# Altium project Pzem004T_Iot.PrjPCB
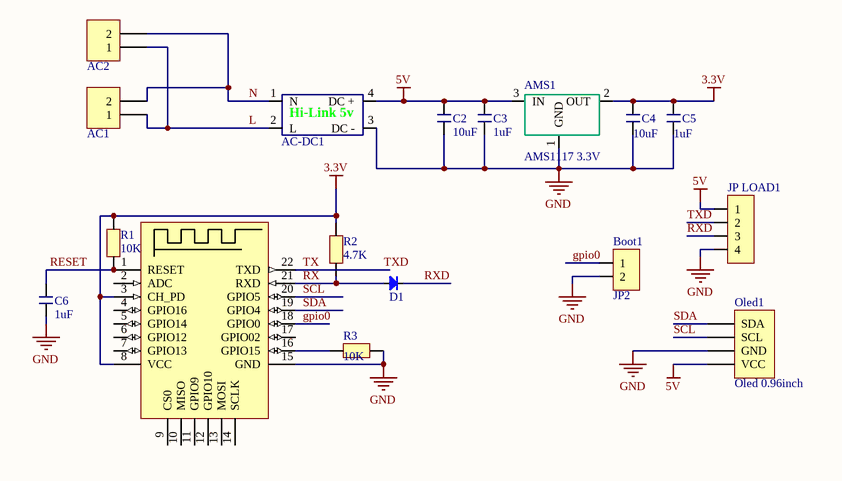
[diagram p0: Schematic.SchDoc]
1 sheet, 17 parts. Net scope: global (net labels, ports and power ports of the same name join across sheets).
Board file: PCB.PcbDoc

## Sheet Schematic.SchDoc
size A

### Parts
AC1  KF2  [KF2-5.08]  (value not drawn)
AC2  KF2  [KF2-5.08]  (value not drawn)
AC-DC1  Hi-link 5v  [Hi-Link]  (value not drawn)
AMS1  AMS1117 3.3V  [AMS-1117]
Boot1  JP2  [JP2-D1T]
C2  10uF  [0805]
C3  1uF  [0805]
C4  10uF  [0805]
C5  1uF  [0805]
C6  1uF  [0805]
D1  Diode  [DIO-1AN]  (value not drawn)
JP_LOAD1  JP4  [JP4-D1C]  (value not drawn)
MCU1  (no value)  [Esp12]
Oled1  Oled 0.96inch  [Oled 0.96]
R1  10K  [0805]
R2  4.7K  [0805]
R3  10K  [0805]

### Nets
3.3V: AMS1.2(OUT) C4.1 C5.1 MCU1.3(CH_PD) MCU1.8(VCC) R1.2 R2.2
5V: AC-DC1.4(DC_+) AMS1.3(IN) C2.1 C3.1 JP_LOAD1.1 Oled1.1(VCC)
GND: AC-DC1.3(DC_-) AMS1.1(GND) Boot1.2 C2.2 C3.2 C4.2 C5.2 C6.2 JP_LOAD1.4 MCU1.15(GND) Oled1.2(GND) R3.2
gpio0: Boot1.1 MCU1.18(GPIO0)
L: AC1.1 AC2.1 AC-DC1.2(L)
N: AC1.2 AC2.2 AC-DC1.1(N)
RESET: C6.1 MCU1.1(RESET) R1.1
RX: D1.1(A) MCU1.21(RXD) R2.1
RXD: D1.2(K) JP_LOAD1.3
SCL: MCU1.20(GPIO5) Oled1.3(SCL)
SDA: MCU1.19(GPIO4) Oled1.4(SDA)
TX: JP_LOAD1.2 MCU1.22(TXD)  [also labelled TXD]
NetMCU1_16: MCU1.16(GPIO15) R3.1

Not connected (* = marked no-connect by the designer): MCU1 2(ADC) 4(GPIO16) 5(GPIO14) 6(GPIO12) 7(GPIO13) 9(CS0) 10(MISO) 11(GPIO9) 12(GPIO10) 13(MOSI) 14(SCLK) 17(GPIO02)

### Notes on the sheet
- (in symbol Hi-link 5v) Hi-Link 5v

### Library data of the parts
AC1 AC2 = KF2: Manufacturer: Würth Elektronik eiSos GmbH; partNo: 691103110002; ComponentLink1 Description: Manufacturer; ComponentLink2 Description: Datasheet; NoPins: 2; Created Date: 29 October 2013; ComponentLink1URL: http://www.we-online.com; ComponentLink2URL: http://katalog.we-online.de/em/datasheet/6911031100xx.pdf; Created by: Karrer Zheng
Boot1 = JP2: WR-PHD 2.54 mm Angled Socket Header; Manufacturer: W¨¹rth Elektronik eiSos GmbH; partNo: 613002143121; ComponentLink1 Description: Manufacturer; ComponentLink2 Description: Datasheet; NoPins: 02; Created Date: 29 March 2013; ComponentLink1URL: http://www.we-online.com; ComponentLink2URL: http://katalog.we-online.de/em/datasheet/6130xx143121.pdf; Created by: Karrer Zheng
C2-C6 = C104 SMD: 0603 SMD CAP
D1 = Diode: Default Diode; Code - JEDEC: DO-214-AB; Value: 1N5007; Published: 8-Jun-2000; Revision: July-2002: Re-released for DXP Platform.; Publisher: Altium Limited
JP_LOAD1 = JP4: WR-PHD 2.54 mm Angled Socket Header; Manufacturer: W¨¹rth Elektronik eiSos GmbH; partNo: 613004143121; ComponentLink1 Description: Manufacturer; ComponentLink2 Description: Datasheet; NoPins: 04; Created Date: 29 March 2013; ComponentLink1URL: http://www.we-online.com; ComponentLink2URL: http://katalog.we-online.de/em/datasheet/6130xx143121.pdf; Created by: Karrer Zheng
MCU1 = ESP12F
R1-R3 = 0603 Res